# Altium schematic sheet pan3029m.SchDoc
size A4; SheetNumber: 1; SheetTotal: 1
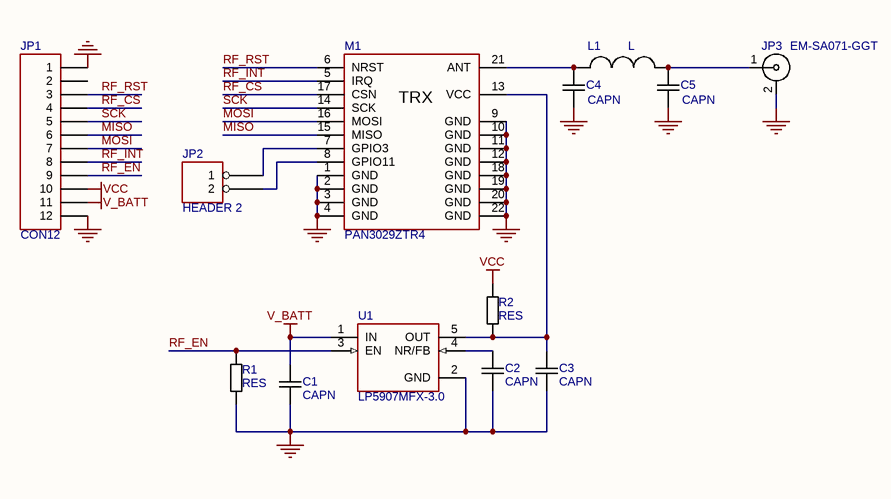
[diagram p0: pan3029m.SchDoc]

## Parts
C1  CAPN  [C-0805]
C2  CAPN  [C-0603]
C3  CAPN  [C-0805]
C4  CAPN  [C-0603]
C5  CAPN  [C-0603]
JP1  CON12  [PBS1-12R]
JP2  HEADER 2  [PLS1-2]
JP3  EM-SA071-GGT  [SMA_F_EDGE]
L1  L  [L-0603]
M1  PAN3029ZTR4  [PAN3029ZTR]
R1  RES  [R-0603]
R2  RES  [R-0603]
U1  LP5907MFX-3.0  [SOT-23-5]

## Nets
GND: C1.2 C2.2 C3.2 C4.2 C5.2 JP1.1 JP1.12 JP3.2 M1.1(GND) M1.2(GND) M1.3(GND) M1.4(GND) M1.9(GND) M1.10(GND) M1.11(GND) M1.12(GND) M1.18(GND) M1.19(GND) M1.20(GND) M1.22(GND) R1.1 U1.2(GND)
V_BATT: C1.1 JP1.11 U1.1(IN)
VCC: JP1.10 R2.2
MISO: JP1.6 M1.15(MISO)
MOSI: JP1.7 M1.16(MOSI)
RF_CS: JP1.4 M1.17(CSN)
RF_EN: JP1.9 R1.2 U1.3(EN)
RF_INT: JP1.8 M1.5(IRQ)
RF_RST: JP1.3 M1.6(NRST)
SCK: JP1.5 M1.14(SCK)
NetC2_1: C2.1 U1.4(NR/FB)
NetC3_1: C3.1 M1.13(VCC) R2.1 U1.5(OUT)
NetC4_1: C4.1 L1.1 M1.21(ANT)
NetC5_1: C5.1 JP3.1 L1.2
NetJP2_1: JP2.1 M1.7(GPIO3)
NetJP2_2: JP2.2 M1.8(GPIO11)

Not connected (* = marked no-connect by the designer): JP1 2

## Notes on the sheet
- (in symbol PAN3029ZTR) TRX

## Library data of the parts
C1-C5 = CAPN: Voltage: 50V; Точність/група: NP0; Вид: Конденсатор
JP1 = CON12: Connector; Вид: Роз'єм; *: *
JP2 = HEADER 2: Вид: Роз'єм; *: *
JP3 = SMA: SMA Female R/A PCB Mount; Вид: Роз'єм
L1 = L: Вид: Індуктивність
M1 = PAN3029ZTR
R1 R2 = RES: Точність/група: 5%; Вид: Резистор
U1 = LP5907: 250mA Low-Dropout Regulator; Вид: Мікросхема